# Altium schematic sheet Power.SchDoc
size A; SheetNumber: 2; SheetTotal: 3
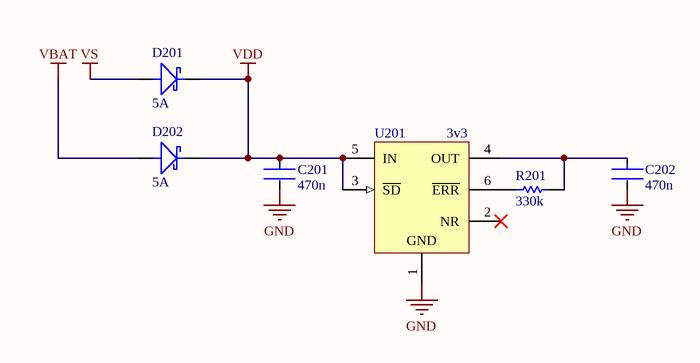
[diagram p0: Power.SchDoc]

## Parts
C201  470n  [FP-GRT155-0_05-MFG]
C202  470n  [FP-GRT155-0_05-MFG]
D201  5A  [SODFL470X105-2L]
D202  5A  [SODFL470X105-2L]
R201  330k  [RESC1005X04N]
U201  3v3  [SOT95P280X145-6L]

## Nets
GND: C201.2 C202.2 U201.1(GND)
VBAT: D202.2
VDD: C201.1 D201.1 D202.1 U201.3(~{SD}) U201.5(IN)
VS: D201.2
NetC202_1: C202.1 R201.1 U201.4(OUT)
NetR201_2: R201.2 U201.6(~{ERR})

Not connected (* = marked no-connect by the designer): U201 2(NR)*

## Library data of the parts
C201 C202 = GRT155R61E474KE01D: Multi-Layer Ceramic Capacitor 470nF 25V X5R ±10% 0402 Paper T/R; Tolerance: 10%; Packaging: Tape and Reel; Capacitance: 470nF; Case Code (Imperial): 0402; Ratings: AEC-Q200; Max Operating Temperature: 85°C; Case/Package: 0402; Length: 0.039inch; Width: 0.02inch; Case Code (Metric): 1005; Mount: Surface Mount; Voltage Rating: 25V; Thickness: 0.022inch; Min Operating Temperature: -55°C; Supplier 1: Digi-Key; Supplier Part Number 1: 490-12269-1-ND
D201 D202 = RB080LAM-30TR: Supplier 1: Digi-Key; Supplier Part Number 1: RB080LAM-30CT-ND
R201 = ERJ-2GEJ334X: Manufacturer: Panasonic; Part Number: ERJ2RKF27R0X; Supplier 1: Digi-Key; Supplier Part Number 1: P330KJCT-ND
U201 = ADP3300ARTZ-3.3RL7: High Accuracy anyCAP(R) 50 mA Low Dropout Linear Regulator, 3 to 12 V Vin, 3.3 V Vout, Industrial, 6-pin SOT23 (RT-6), Reel; Manufacturer: Analog Devices; Supply Current IGND @ Small Load: 190uA; Vin (max) (V): 12; Iout max: 50mA; Vin (min) (V): 3; Preset Vout Values (V): 3.3; PackageReference: RT-6; Packing: Reel; ComponentLink2Description: Datasheet; ComponentLink4URL: Product URL:http://www.analog.com/en/ADP3300/productSearch.html; ComponentLink3Description: Package Specification; ComponentLink4Description: URL Link1; ComponentLink2URL: http://www.analog.com/static/imported-files/data_sheets/ADP3300.pdf; ComponentLink1URL: http://www.analog.com/en/index.html; PartNumber: ADP3300ARTZ-3.3RL7; Mounting Technology: Surface Mount; PackageDescription: 6-Pin Plastic Surface Mount SOT-23 Package, Body 2.9 x 1.65 mm, Pitch 0.95 mm; ComponentLink3URL: http://www.analog.com/static/imported-files/data_sheets/ADG465.pdf; PackageVersion: REV. A, 11/2006; ComponentLink1Description: Manufacturer URL; DatasheetVersion: Rev. B; Supplier 1: Digi-Key; Supplier Part Number 1: ADP3300ARTZ3.3RCT-ND